# EAGLE schematic Display Board (EAGLE 8.2.1)
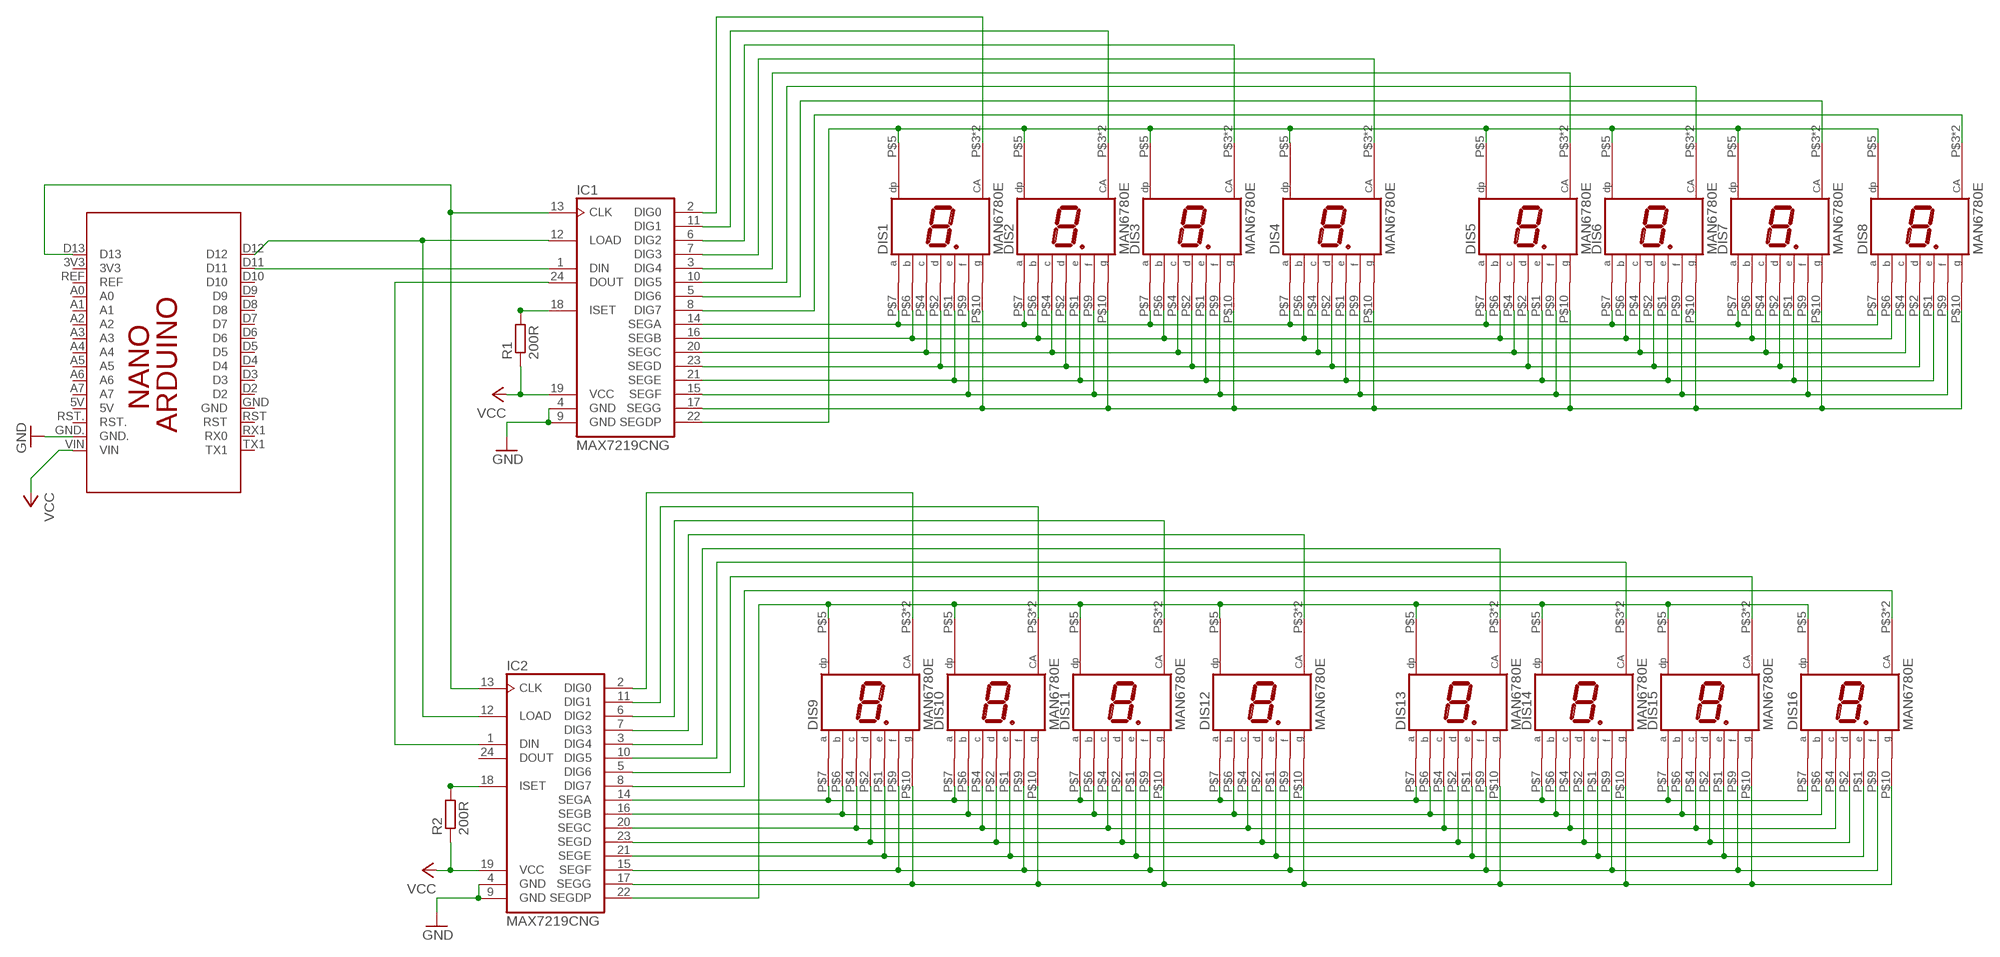
[diagram p0: schematic, sheet 1]

## Parts
DIS1  MAN6780E  [MAN6780]
DIS2  MAN6780E  [MAN6780]
DIS3  MAN6780E  [MAN6780]
DIS4  MAN6780E  [MAN6780]
DIS5  MAN6780E  [MAN6780]
DIS6  MAN6780E  [MAN6780]
DIS7  MAN6780E  [MAN6780]
DIS8  MAN6780E  [MAN6780]
DIS9  MAN6780E  [MAN6780]
DIS10  MAN6780E  [MAN6780]
DIS11  MAN6780E  [MAN6780]
DIS12  MAN6780E  [MAN6780]
DIS13  MAN6780E  [MAN6780]
DIS14  MAN6780E  [MAN6780]
DIS15  MAN6780E  [MAN6780]
DIS16  MAN6780E  [MAN6780]
IC1  MAX7219CNG  [DIL24-3]
IC2  MAX7219CNG  [DIL24-3]
PCB1  ARDUINO_NANO  [ARDUINO_NANO]
R1  200R  R-EU_M1206  [M1206]
R2  200R  R-EU_M1206  [M1206]

## Nets
GND: IC1.4(GND) IC1.9(GND) IC2.4(GND) IC2.9(GND) PCB1.GND.
N$1: DIS1.P$7(A) DIS2.P$7(A) DIS3.P$7(A) DIS4.P$7(A) DIS5.P$7(A) DIS6.P$7(A) DIS7.P$7(A) DIS8.P$7(A) IC1.14(SEGA)
N$2: DIS1.P$6(B) DIS2.P$6(B) DIS3.P$6(B) DIS4.P$6(B) DIS5.P$6(B) DIS6.P$6(B) DIS7.P$6(B) DIS8.P$6(B) IC1.16(SEGB)
N$3: DIS1.P$4(C) DIS2.P$4(C) DIS3.P$4(C) DIS4.P$4(C) DIS5.P$4(C) DIS6.P$4(C) DIS7.P$4(C) DIS8.P$4(C) IC1.20(SEGC)
N$4: DIS1.P$2(D) DIS2.P$2(D) DIS3.P$2(D) DIS4.P$2(D) DIS5.P$2(D) DIS6.P$2(D) DIS7.P$2(D) DIS8.P$2(D) IC1.23(SEGD)
N$5: DIS1.P$1(E) DIS2.P$1(E) DIS3.P$1(E) DIS4.P$1(E) DIS5.P$1(E) DIS6.P$1(E) DIS7.P$1(E) DIS8.P$1(E) IC1.21(SEGE)
N$6: DIS1.P$9(F) DIS2.P$9(F) DIS3.P$9(F) DIS4.P$9(F) DIS5.P$9(F) DIS6.P$9(F) DIS7.P$9(F) DIS8.P$9(F) IC1.15(SEGF)
N$7: DIS1.P$10(G) DIS2.P$10(G) DIS3.P$10(G) DIS4.P$10(G) DIS5.P$10(G) DIS6.P$10(G) DIS7.P$10(G) DIS8.P$10(G) IC1.17(SEGG)
N$8: DIS1.P$5(DP) DIS2.P$5(DP) DIS3.P$5(DP) DIS4.P$5(DP) DIS5.P$5(DP) DIS6.P$5(DP) DIS7.P$5(DP) DIS8.P$5(DP) IC1.22(SEGDP)
N$9: DIS1.P$3(CA) DIS1.P$8(CA) IC1.2(DIG0)
N$10: DIS2.P$3(CA) DIS2.P$8(CA) IC1.11(DIG1)
N$11: DIS3.P$3(CA) DIS3.P$8(CA) IC1.6(DIG2)
N$12: DIS4.P$3(CA) DIS4.P$8(CA) IC1.7(DIG3)
N$13: DIS5.P$3(CA) DIS5.P$8(CA) IC1.3(DIG4)
N$14: DIS6.P$3(CA) DIS6.P$8(CA) IC1.10(DIG5)
N$15: DIS9.P$7(A) DIS10.P$7(A) DIS11.P$7(A) DIS12.P$7(A) DIS13.P$7(A) DIS14.P$7(A) DIS15.P$7(A) DIS16.P$7(A) IC2.14(SEGA)
N$16: DIS8.P$3(CA) DIS8.P$8(CA) IC1.8(DIG7)
N$17: DIS9.P$6(B) DIS10.P$6(B) DIS11.P$6(B) DIS12.P$6(B) DIS13.P$6(B) DIS14.P$6(B) DIS15.P$6(B) DIS16.P$6(B) IC2.16(SEGB)
N$18: DIS7.P$3(CA) DIS7.P$8(CA) IC1.5(DIG6)
N$19: DIS9.P$4(C) DIS10.P$4(C) DIS11.P$4(C) DIS12.P$4(C) DIS13.P$4(C) DIS14.P$4(C) DIS15.P$4(C) DIS16.P$4(C) IC2.20(SEGC)
N$20: DIS9.P$2(D) DIS10.P$2(D) DIS11.P$2(D) DIS12.P$2(D) DIS13.P$2(D) DIS14.P$2(D) DIS15.P$2(D) DIS16.P$2(D) IC2.23(SEGD)
N$21: DIS9.P$1(E) DIS10.P$1(E) DIS11.P$1(E) DIS12.P$1(E) DIS13.P$1(E) DIS14.P$1(E) DIS15.P$1(E) DIS16.P$1(E) IC2.21(SEGE)
N$22: DIS9.P$9(F) DIS10.P$9(F) DIS11.P$9(F) DIS12.P$9(F) DIS13.P$9(F) DIS14.P$9(F) DIS15.P$9(F) DIS16.P$9(F) IC2.15(SEGF)
N$23: IC1.18(ISET) R1.2
N$24: DIS9.P$10(G) DIS10.P$10(G) DIS11.P$10(G) DIS12.P$10(G) DIS13.P$10(G) DIS14.P$10(G) DIS15.P$10(G) DIS16.P$10(G) IC2.17(SEGG)
N$25: DIS9.P$5(DP) DIS10.P$5(DP) DIS11.P$5(DP) DIS12.P$5(DP) DIS13.P$5(DP) DIS14.P$5(DP) DIS15.P$5(DP) DIS16.P$5(DP) IC2.22(SEGDP)
N$26: DIS9.P$3(CA) DIS9.P$8(CA) IC2.2(DIG0)
N$27: DIS10.P$3(CA) DIS10.P$8(CA) IC2.11(DIG1)
N$28: DIS11.P$3(CA) DIS11.P$8(CA) IC2.6(DIG2)
N$29: DIS12.P$3(CA) DIS12.P$8(CA) IC2.7(DIG3)
N$30: DIS13.P$3(CA) DIS13.P$8(CA) IC2.3(DIG4)
N$31: DIS14.P$3(CA) DIS14.P$8(CA) IC2.10(DIG5)
N$32: DIS16.P$3(CA) DIS16.P$8(CA) IC2.8(DIG7)
N$33: DIS15.P$3(CA) DIS15.P$8(CA) IC2.5(DIG6)
N$34: IC2.18(ISET) R2.2
N$35: IC1.24(DOUT) IC2.1(DIN)
N$36: IC1.13(CLK) IC2.13(CLK) PCB1.D13
N$37: IC1.12(LOAD) IC2.12(LOAD) PCB1.D12
N$38: IC1.1(DIN) PCB1.D11
VCC: IC1.19(VCC) IC2.19(VCC) PCB1.VIN R1.1 R2.1
Unconnected: IC2.24(DOUT) PCB1.3V3 PCB1.5V PCB1.A0 PCB1.A1 PCB1.A2 PCB1.A3 PCB1.A4 PCB1.A5 PCB1.A6 PCB1.A7 PCB1.D2 PCB1.D3 PCB1.D4 PCB1.D5 PCB1.D6 PCB1.D7 PCB1.D8 PCB1.D9 PCB1.D10 PCB1.GND PCB1.REF PCB1.RST PCB1.RST. PCB1.RX1(RX0) PCB1.TX1

## Library data of the parts
DIS1-DIS16 = 7segment:MAN6780E: LED DISPLAY 1-character 7 segment, decimal point right
IC1 IC2 = maxim:MAX7219CNG: LED DISPLAY DRIVER; MF: MAXIM; MPN: MAX7219CNG; OC_FARNELL: 1523914; OC_NEWARK: 34C4018
PCB1 = E14_Arduino_revC:ARDUINO_NANO: Device for representing an Arduino Nano board with a footprint in an EAGLE design. Created by Dave Young for Element14. More EAGLE documentation at: http://www.element14.com/community/community/knode/cadsoft_eagle
R1 R2 = resistor:R-EU_: RESISTOR, European symbol